# Altium schematic sheet Structure.SchDoc
size 420 x 297 mm; SheetNumber: 1; SheetTotal: 3
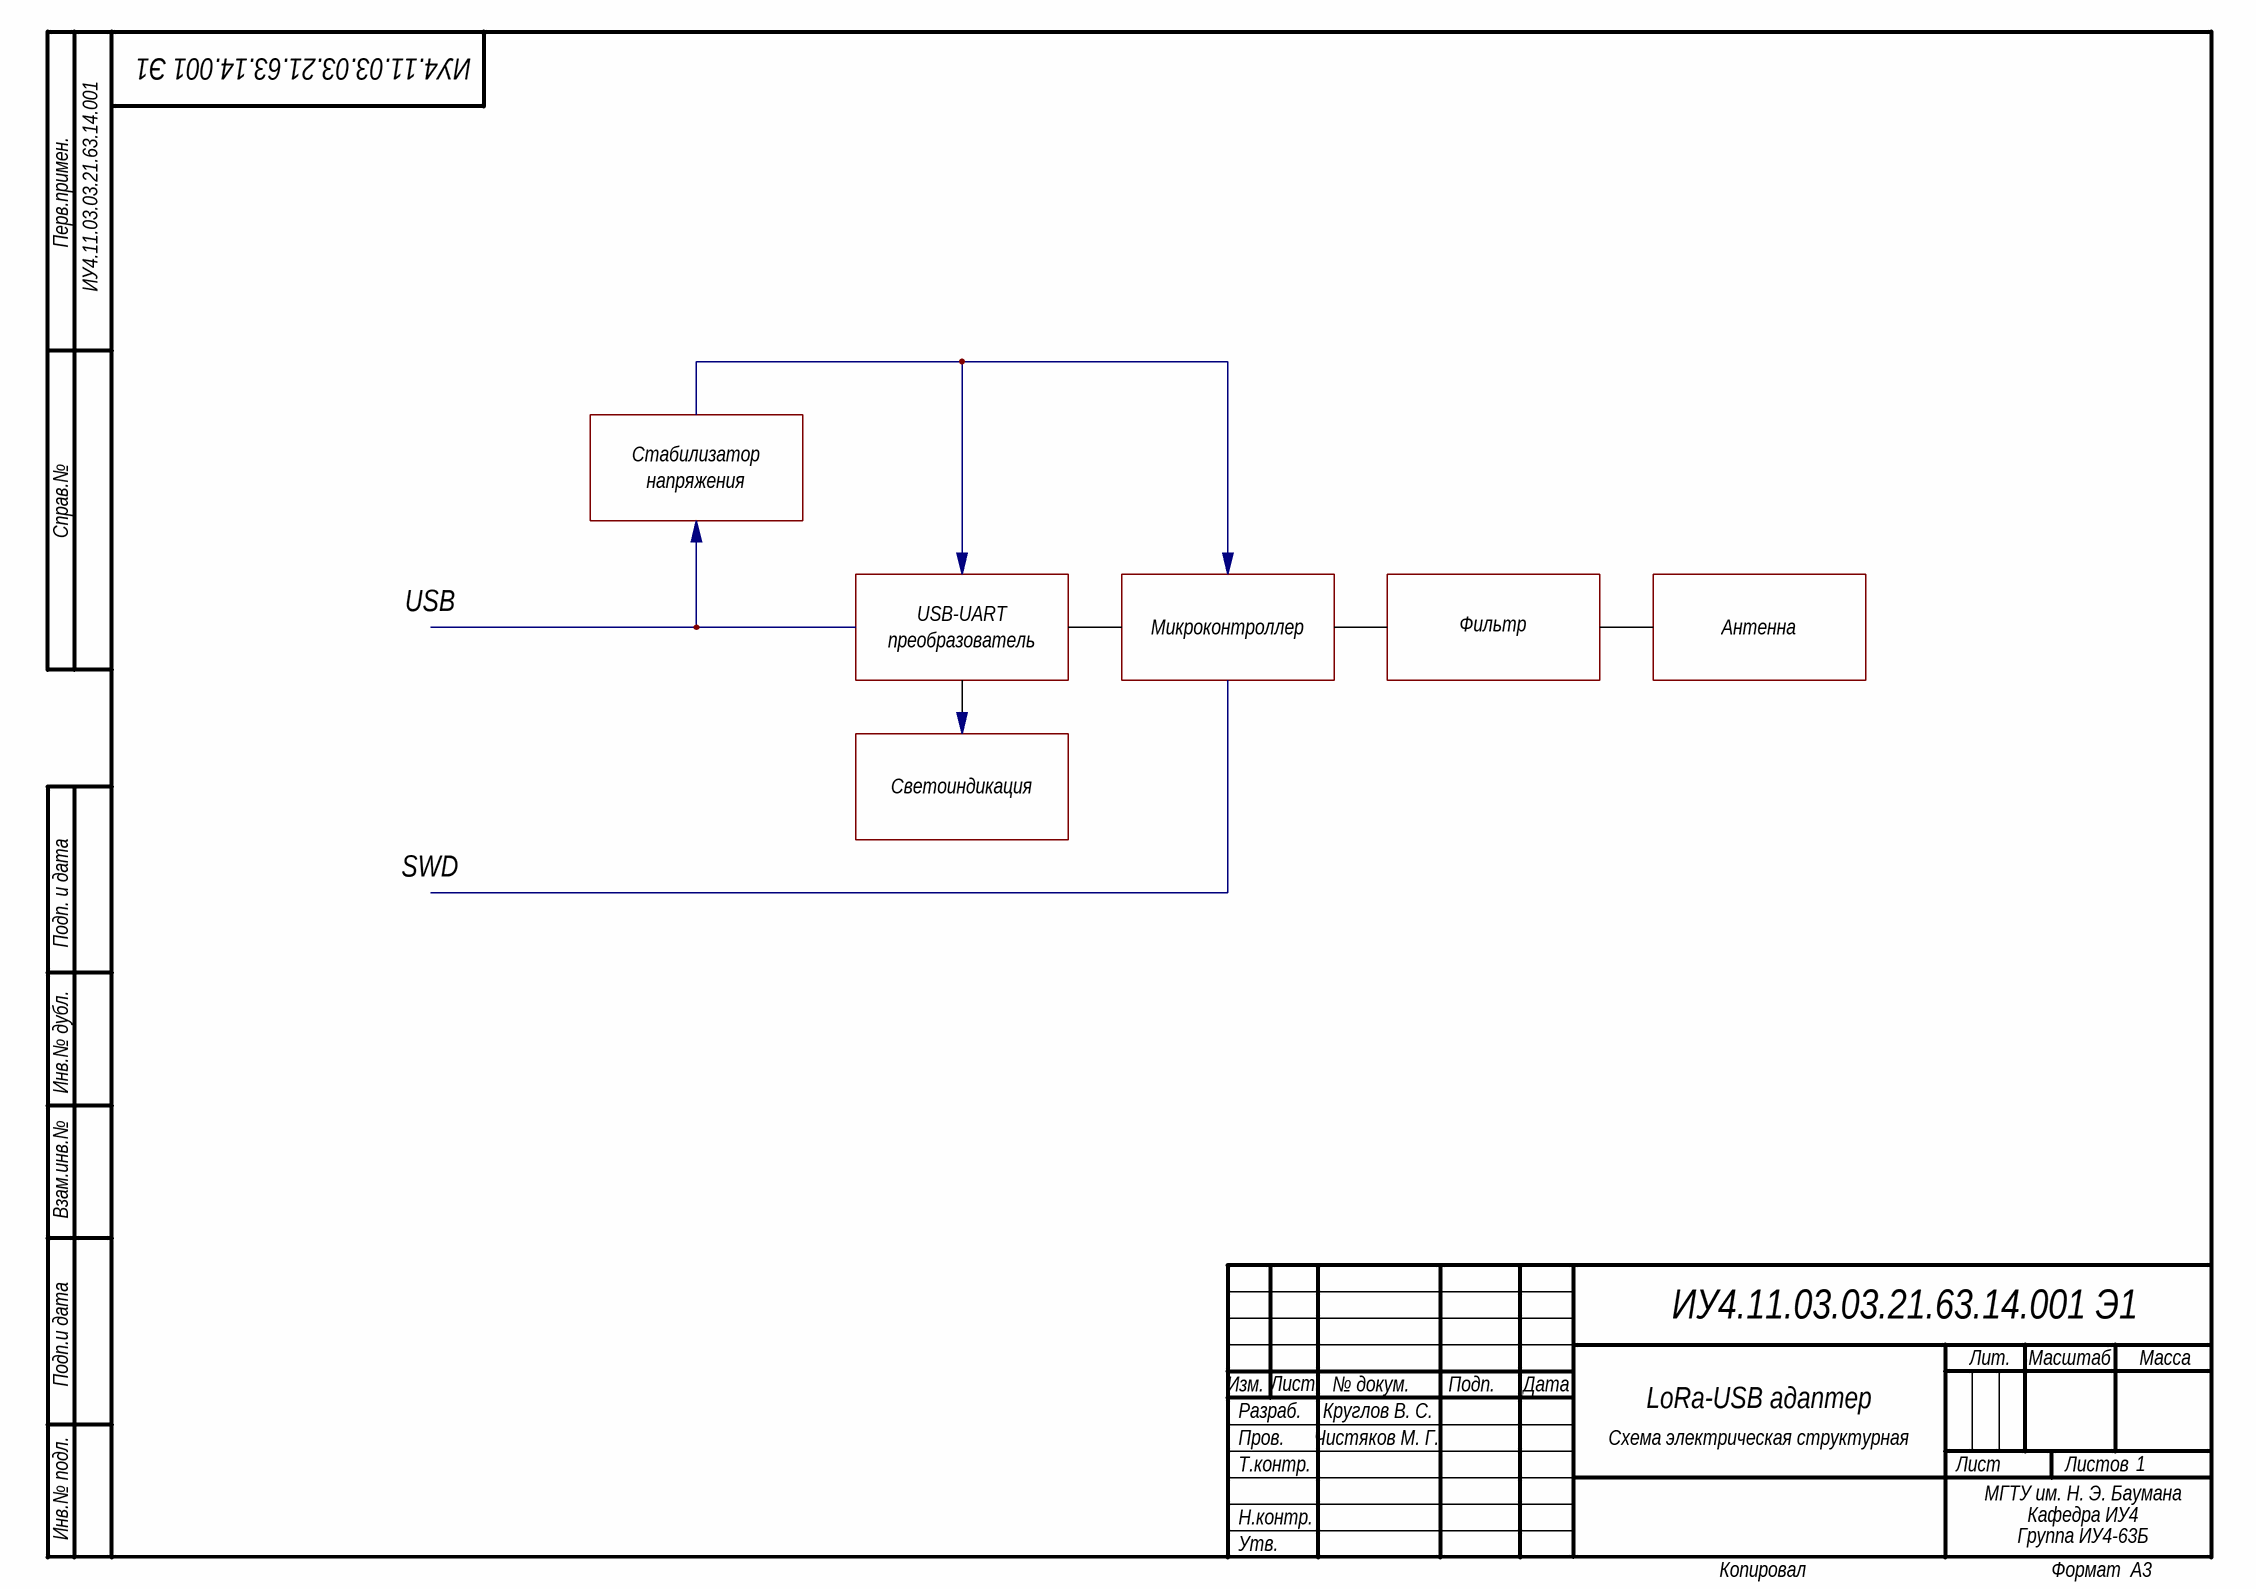
[diagram p0: Structure.SchDoc]

## Notes on the sheet
- ИУ4.11.03.03.21.63.14.001 Э1
- ИУ4.11.03.03.21.63.14.001
- Стабилизатор
- напряжения
- USB
- USB-UART
- преобразователь
- Микроконтроллер
- Фильтр
- Антенна
- Светоиндикация
- SWD
- Круглов В. С.
- LoRa-USB адаптер
- Чистяков М. Г.
- Схема электрическая структурная
- 1
- МГТУ им. Н. Э. Баумана
- Кафедра ИУ4
- Группа ИУ4-63Б
- Перв.примен.
- Справ.№
- Подп. и дата
- Инв.№ дубл.
- Взам.инв.№
- Подп.и дата
- Разраб.
- Изм.
- Лист
- № докум.
- Подп.
- Дата
- Лит.
- Масштаб
- Масса
- Т.контр.
- Пров.
- Листов
- Инв.№ подл.
- Утв.
- Н.контр.
- Копировал
- Формат  A3